# EAGLE design tk-retrofit (EAGLE 9.5.0)
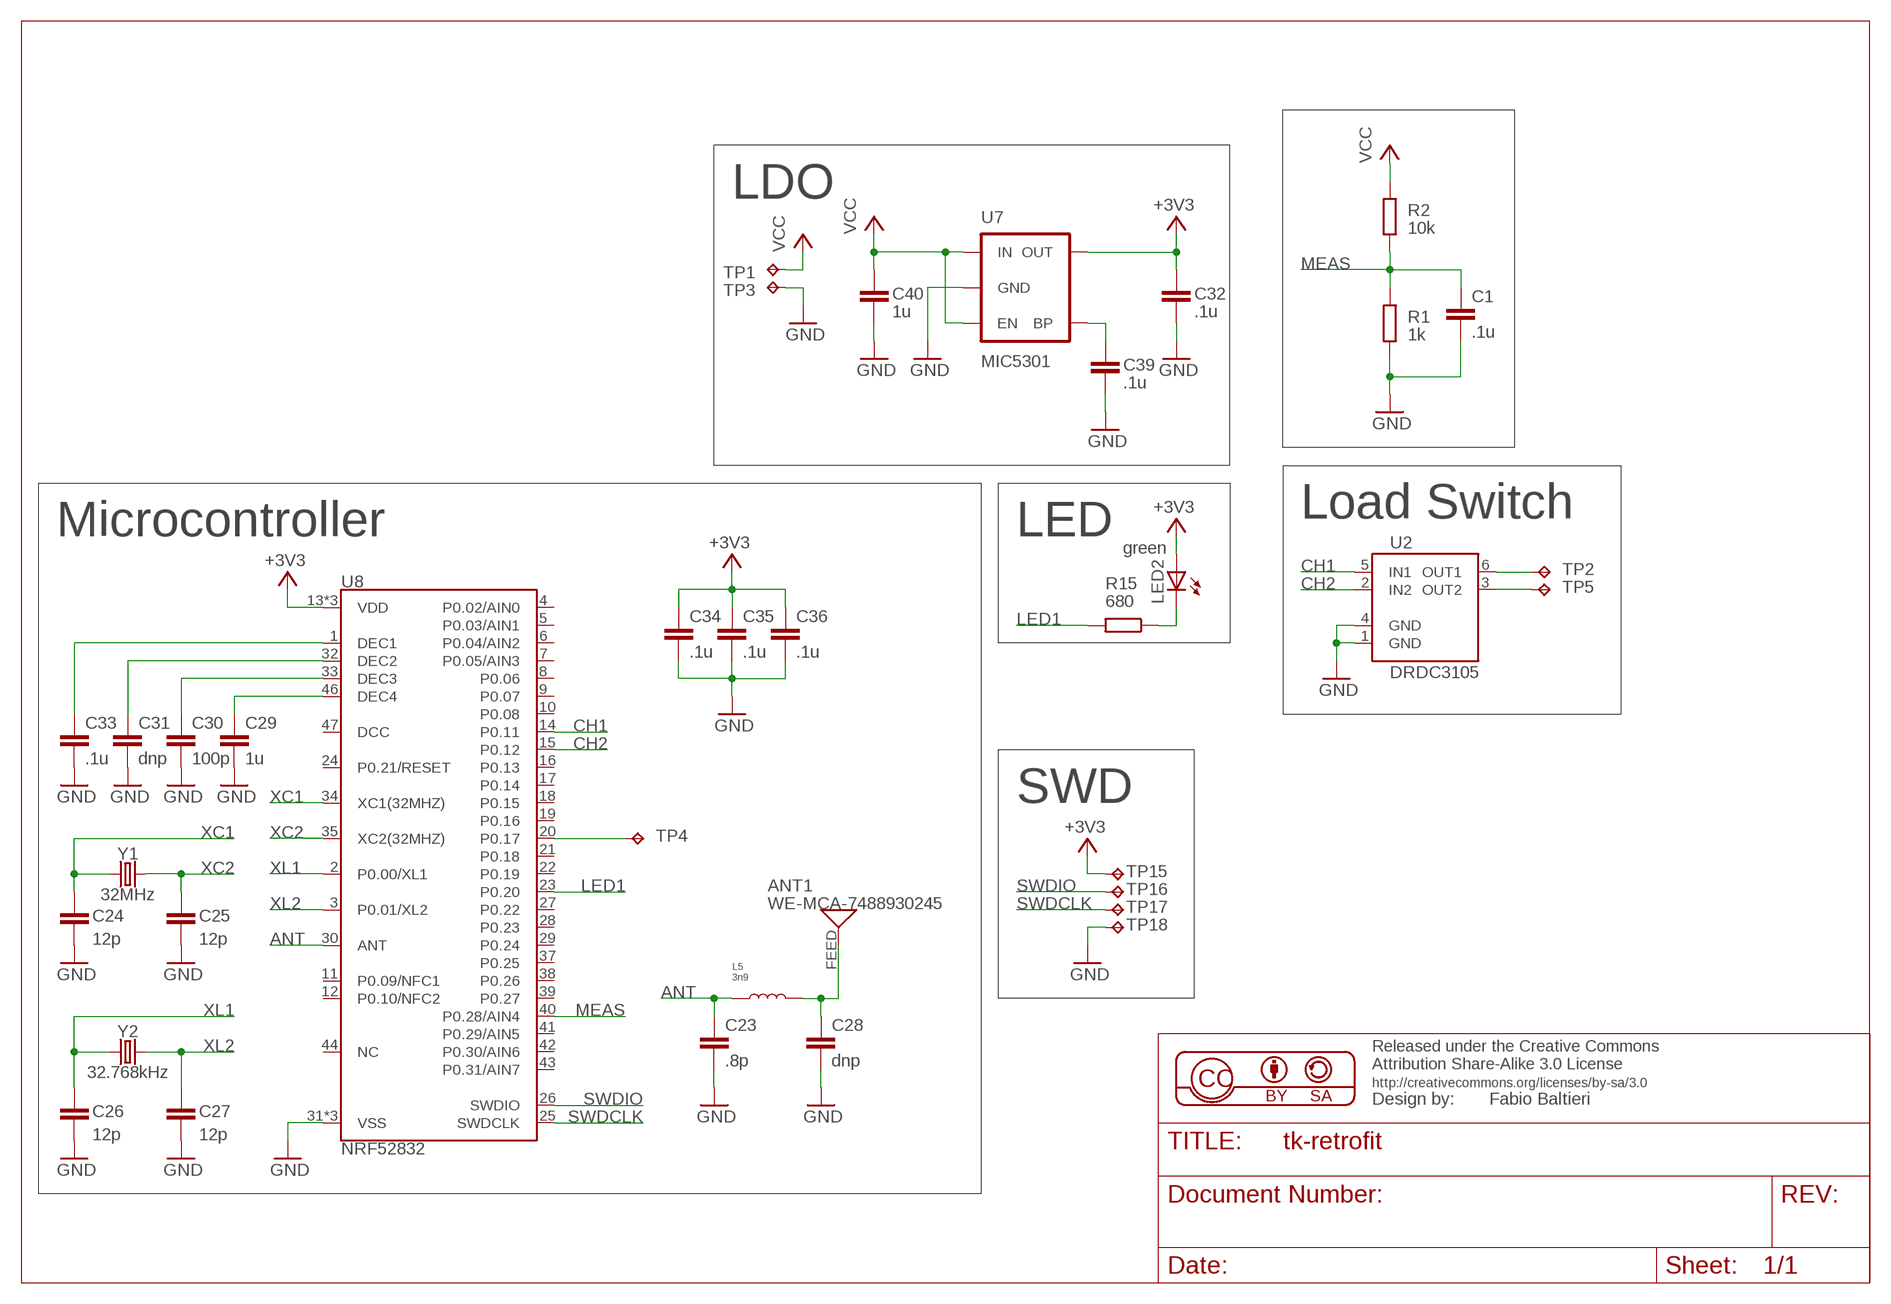
[diagram p0: schematic, sheet 1]

## Parts
ANT1  WE-MCA-7488930245  [WE-MCA]
C1  .1u  C0603  [0603]
C23  .8p  C0603  [0603]
C24  12p  C0603  [0603]
C25  12p  C0603  [0603]
C26  12p  C0603  [0603]
C27  12p  C0603  [0603]
C28  dnp  C0603  [0603]
C29  1u  C0603  [0603]
C30  100p  C0603  [0603]
C31  dnp  C0603  [0603]
C32  .1u  C0603  [0603]
C33  .1u  C0603  [0603]
C34  .1u  C0603  [0603]
C35  .1u  C0603  [0603]
C36  .1u  C0603  [0603]
C39  .1u  C0603  [0603]
C40  1u  C0603  [0603]
L5  3n9  INDUCTOR_0603  [L0603]
LED2  LEDSML0805  [SML0805]
R1  1k  R0603  [0603]
R2  10k  R0603  [0603]
R15  680  R0603  [0603]
TP1  TPTP12R  [TP12R]
TP2  TPTP12R  [TP12R]
TP3  TPTP12R  [TP12R]
TP4  TPTP12R  [TP12R]
TP5  TPTP12R  [TP12R]
TP15  TPTP12R  [TP12R]
TP16  TPTP12R  [TP12R]
TP17  TPTP12R  [TP12R]
TP18  TPTP12R  [TP12R]
U2  DRDC3105  [SOT23-6L]
U7  MIC5301  V_REG_LDOSMD  [SOT23-5]
U8  NRF52832  [QFN48-6X6MM]
Y1  32MHz  CRYSTALSMD-3.2X2.5  [CRYSTAL-SMD-3.2X2.5MM]
Y2  32.768kHz  CRYSTAL-32.768KHZSMD-3.2X1.5  [CRYSTAL-SMD-3.2X1.5MM]

## Nets
+3V3: C32.1 C34.1 C35.1 C36.1 LED2.A TP15.TP U7.5(OUT) U8.13(VDD) U8.36(VDD) U8.48(VDD)
ANT: C23.1 L5.P$1 U8.30(ANT)
CH1: U2.5(IN1) U8.14(P0.11)
CH2: U2.2(IN2) U8.15(P0.12)
GND: C1.2 C23.2 C24.2 C25.2 C26.2 C27.2 C28.2 C29.2 C30.2 C31.2 C32.2 C33.2 C34.2 C35.2 C36.2 C39.2 C40.2 R1.2 TP3.TP TP18.TP U2.1(GND) U2.4(GND) U7.2(GND) U8.31(VSS) U8.45(VSS) U8.EP(VSS)
LED1: R15.2 U8.23(P0.20)
MEAS: C1.1 R1.1 R2.2 U8.40(P0.28/AIN4)
N$1: TP2.TP U2.6(OUT1)
N$3: TP5.TP U2.3(OUT2)
N$11: TP4.TP U8.20(P0.17)
N$22: ANT1.FEED C28.1 L5.P$2
N$23: LED2.C R15.1
N$24: C29.1 U8.46(DEC4)
N$25: C30.1 U8.33(DEC3)
N$26: C31.1 U8.32(DEC2)
N$27: C33.1 U8.1(DEC1)
N$30: C39.1 U7.4(BP)
SWDCLK: TP17.TP U8.25(SWDCLK)
SWDIO: TP16.TP U8.26(SWDIO)
VCC: C40.1 R2.1 TP1.TP U7.1(IN) U7.3(EN)
XC1: C24.1 U8.34(XC1(32MHZ)) Y1.1
XC2: C25.1 U8.35(XC2(32MHZ)) Y1.3
XL1: C26.1 U8.2(P0.00/XL1) Y2.P$1
XL2: C27.1 U8.3(P0.01/XL2) Y2.P$2
Unconnected: U8.4(P0.02/AIN0) U8.5(P0.03/AIN1) U8.6(P0.04/AIN2) U8.7(P0.05/AIN3) U8.8(P0.06) U8.9(P0.07) U8.10(P0.08) U8.11(P0.09/NFC1) U8.12(P0.10/NFC2) U8.16(P0.13) U8.17(P0.14) U8.18(P0.15) U8.19(P0.16) U8.21(P0.18) U8.22(P0.19) U8.24(P0.21/RESET) U8.27(P0.22) U8.28(P0.23) U8.29(P0.24) U8.37(P0.25) U8.38(P0.26) U8.39(P0.27) U8.41(P0.29/AIN5) U8.42(P0.30/AIN6) U8.43(P0.31/AIN7) U8.44(NC) U8.47(DCC)

## Notes on the sheet
- LDO
- Load Switch
- Microcontroller | LED
- green
- SWD

## Library data of the parts
ANT1 = balto:WE-MCA: Wurth WE-MCA Multilayer Chip Antenna
C1 C23-C36 C39 C40 = balto:C: Capacitor
L5 = MF_Passives:INDUCTOR: Library: MF_Passives Description: Device for Inductors. Manufacture part number (MPN) can be added via Attributes. Check https://factory.macrofab.com/parts for the house parts list.; POPULATE: 1
LED2 = led:LED: LED OSRAM: - CHIPLED LG R971, LG N971, LY N971, LG Q971, LY Q971, LO R971, LY R971 LH N974, LH R974 LS Q976, LO Q976, LY Q976 LO Q996 - Hyper CHIPLED LW Q18S LB Q993, LB Q99A, LB R99A - SideLED LS A670, LO A670, LY A670, LG A670, LP A670 LB A673, LV A673, LT A673, LW A673 LH A674 LY A675 LS A676, LA A676, LO A676, LY A676, LW A676 LS A679, LY A679, LG A679 - Hyper Micro SIDELED® LS Y876, LA Y876, LO Y876, LY Y876 LT Y87S - SmartLED LW L88C, LW L88S LB L89C, LB L89S, LG L890 LS L89K, LO L89K, LY L89K LS L896, LA L896, LO L896, LY L896 - TOPLED LS T670, LO T670, LY T670, LG T670, LP T670 LSG T670, LSP T670, LSY T670, LOP T670, LYG T670 LG T671, LOG T671, LSG T671 LB T673, LV T673, LT T673, LW T673 LH T674 LS T676, LA T676, LO T676, LY T676, LB T676, LH T676, LSB T676, LW T676 LB T67C, LV T67C, LT T67C, LS T67K, LO T67K, LY T67K, LW E67C LS E67B, LA E67B, LO E67B, LY E67B, LB E67C, LV E67C, LT E67C LW T67C LS T679, LY T679, LG T679 LS T770, LO T770, LY T770, LG T770, LP T770 LB T773, LV T773, LT T773, LW T773 LH T774 LS E675, LA E675, LY E675, LS T675 LS T776, LA T776, LO T776, LY T776, LB T776 LHGB T686 LT T68C, LB T68C - Hyper Mini TOPLED® LB M676 - Mini TOPLED Santana® LG M470 LS M47K, LO M47K, LY M47K Source: http://www.osram.convergy.de LUXEON: - LUMILED® LXK2-PW12-R00, LXK2-PW12-S00, LXK2-PW14-U00, LXK2-PW14-V00 LXK2-PM12-R00, LXK2-PM12-S00, LXK2-PM14-U00 LXK2-PE12-Q00, LXK2-PE12-R00, LXK2-PE12-S00, LXK2-PE14-T00, LXK2-PE14-U00 LXK2-PB12-K00, LXK2-PB12-L00, LXK2-PB12-M00, LXK2-PB14-N00, LXK2-PB14-P00, LXK2-PB14-Q00 LXK2-PR12-L00, LXK2-PR12-M00, LXK2-PR14-Q00, LXK2-PR14-R00 LXK2-PD12-Q00, LXK2-PD12-R00, LXK2-PD12-S00 LXK2-PH12-R00, LXK2-PH12-S00 LXK2-PL12-P00, LXK2-PL12-Q00, LXK2-PL12-R00 Source: www.luxeon.com KINGBRIGHT: KA-3528ASYC Source: www.kingbright.com
R1 R2 R15 = balto:R: Resistor
TP1-TP5 TP15-TP18 = testpad:TP: Test pad
U2 = balto:DRDC3105: Integrated relay and inductive load driver https://www.mouser.ie/datasheet/2/115/DRDC3105-219294.pdf
U7 = SparkFun-PowerIC:V_REG_LDO: Voltage Regulator LDO Standard 150mA LDO voltage regulator in SOT-23 layout. Micrel part MIC5205. BP (by-pass) pin is used to lower output noise with 470pF cap.
U8 = SparkFun-RF:NRF52832: Nordic nRF52832 Bluetooth Smart/ANT/2.4GHz RF SoC The nRF52832 SoC is a powerful, highly flexible ultra-low power multiprotocol SoC ideally suited for Bluetooth® Smart ANT and 2.4GHz ultra low-power wireless applications. The nRF52832 SoC is built around a 32-bit ARM® Cortex™-M4F CPU with 512kB + 64kB RAM. The embedded 2.4GHz transceiver supports Bluetooth Smart, ANT and proprietary 2.4 GHz protocol stack. It is on air compatible with the nRF51 Series, nRF24L and nRF24AP Series products from Nordic Semiconductor. Datasheet <https://cdn.sparkfun.com/datasheets/Wireless/Bluetooth/nRF52832_PS_v1.0.pdf> SparkFun Products: SparkFun nRF52832 Breakout <https://www.sparkfun.com/products/13990>; PROD_ID: IC-13460
Y1 = SparkFun-Clocks:CRYSTAL: Crystals (Generic) These are passive quartz crystals, which can be used as a clock source for a microcontroller. Crystal's are two-terminal devices. They require external "load" capacitors to generate an oscillating signal.
Y2 = SparkFun-Clocks:CRYSTAL-32.768KHZ: 32.768kHz Crystal Frequency: 32.768kHz Frequency Stability: ±20ppm Load Capacitance: 12.5pF (PTH-2X6 & SMD-3.2X1.5), 6pF (SMD-2X6) SparkFun Products: SparkFun BigTime Watch Kit <https://www.sparkfun.com/products/11734> SparkFun nRF52832 Breakout <https://www.sparkfun.com/products/13990> SparkFun Real Time Clock Module <https://www.sparkfun.com/products/12708>; PROD_ID: XTAL-13062

## Board
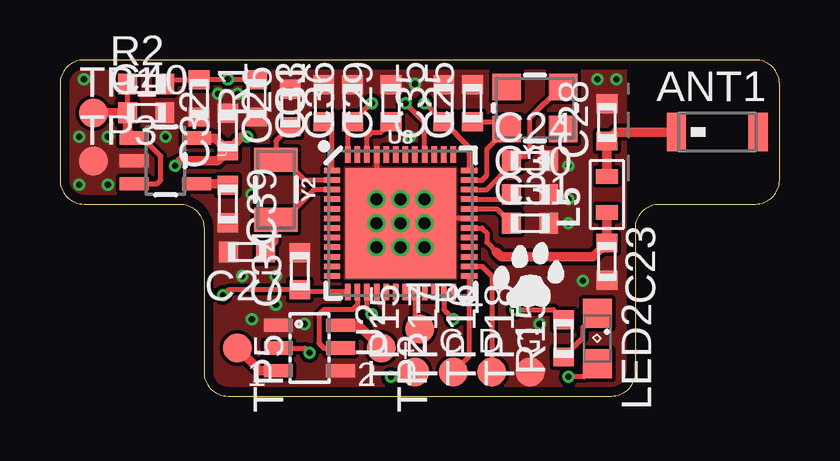
[diagram p1: board, top side]
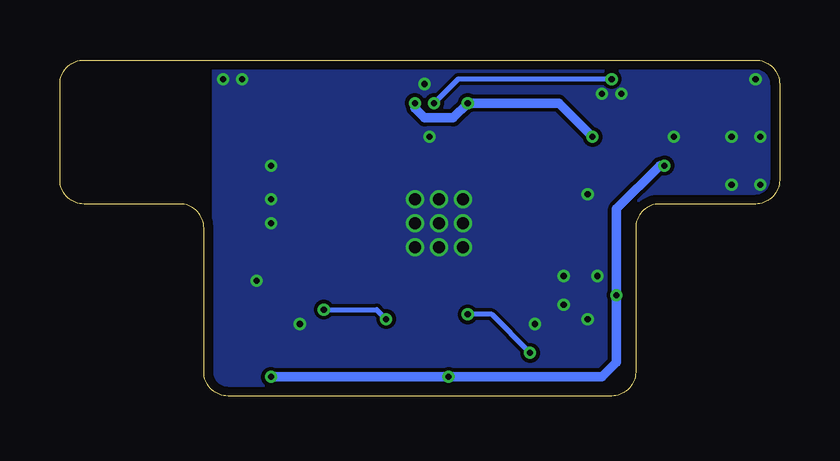
[diagram p2: board, bottom side, seen from below]

Size 30 x 14 mm. Coordinates in mm from the lower left corner, seen from the top.
Outline: 25,8 29,8 arc90 30,9 30,13 arc90 29,14 1,14 arc90 0,13 0,9 arc90 1,8 5,8 arc-90 6,7 6,1 arc90 7,0 23,0 arc90 24,1 24,7 arc-90 25,8
Copper layers (1*16): Top 0.035mm / dielectric 1.5mm / Bottom 0.035mm
Design rules "balto": minimum track width 6mil, minimum drill 10mil, track to track 6mil, track to pad 6mil, pad to pad 6mil, via to via 6mil, smd to smd 6mil, copper to edge 15mil, drill to drill 5mil, minimum pad ring 5mil, minimum via ring 5mil, stop-mask expansion 2mil, vias tented up to drill 20mil, thermal gap 8mil

### Footprints (pad centres in the part's own frame; a part is rotated, then mirrored left to right if it is on the bottom)
WE-MCA = smd 0.8 x 1.6: FEED -1.7,0; NC 1.7,0
0603 = smd 0.787 x 0.864: 1 -0.774,0; 2 0.774,0
L0603 = smd 0.6 x 0.9: P$1 -0.75,0; P$2 0.75,0
SML0805 = smd 1.2 x 1.2: A 1.05,0; C -1.05,0
TP12R = smd 1.2 x 1.2: TP 0,0
SOT23-6L = smd 0.55 x 1.2: 1 -0.95,-1.3; 2 0,-1.3; 3 0.95,-1.3; 4 0.95,1.3; 5 0,1.3; 6 -0.95,1.3
SOT23-5 = smd 0.55 x 1.2: 1 -0.95,-1.3; 2 0,-1.3; 3 0.95,-1.3; 4 0.95,1.3; 5 -0.95,1.3
QFN48-6X6MM = smd 0.68 x 0.23: 1 -2.86,2.2; 2 -2.86,1.8; 3 -2.86,1.4; 4 -2.86,1; 5 -2.86,0.6; 6 -2.86,0.2; 7 -2.86,-0.2; 8 -2.86,-0.6; 9 -2.86,-1; 10 -2.86,-1.4; 11 -2.86,-1.8; 12 -2.86,-2.2; 25 2.86,-2.2; 26 2.86,-1.8; 27 2.86,-1.4; 28 2.86,-1; 29 2.86,-0.6; 30 2.86,-0.2; 31 2.86,0.2; 32 2.86,0.6; 33 2.86,1; 34 2.86,1.4; 35 2.86,1.8; 36 2.86,2.2 | smd 0.23 x 0.68: 13 -2.2,-2.86; 14 -1.8,-2.86; 15 -1.4,-2.86; 16 -1,-2.86; 17 -0.6,-2.86; 18 -0.2,-2.86; 19 0.2,-2.86; 20 0.6,-2.86; 21 1,-2.86; 22 1.4,-2.86; 23 1.8,-2.86; 24 2.2,-2.86; 37 2.2,2.86; 38 1.8,2.86; 39 1.4,2.86; 40 1,2.86; 41 0.6,2.86; 42 0.2,2.86; 43 -0.2,2.86; 44 -0.6,2.86; 45 -1,2.86; 46 -1.4,2.86; 47 -1.8,2.86; 48 -2.2,2.86 | smd 4.6 x 4.6: EP 0,0
CRYSTAL-SMD-3.2X2.5MM = smd 1.2 x 1.1: 1 -1.175,-0.875; 2 1.175,-0.875; 3 1.175,0.875; 4 -1.175,0.875
CRYSTAL-SMD-3.2X1.5MM = smd 1 x 1.8: P$1 -1.25,0; P$2 1.25,0

### Placement (x,y rotation side)
ANT1  27.4,11 0 top
C1  8.2,12.4 270 top
C23  22.8,5.6 270 top
C24  19.6,9.8 0 top
C25  17.2,12.2 90 top
C26  9.6,12 90 top
C27  7.8,6 180 top
C28  22.8,11.4 90 top
C29  13.8,12.2 90 top
C30  19.6,8.4 0 top
C31  19.6,7.2 0 top
C32  7,11 90 top
C33  11,12.2 90 top
C34  10,5.2 90 top
C35  16,12.2 90 top
C36  12.2,12.2 90 top
C39  7,8 270 top
C40  3.6,11.8 0 top
L5  22.8,8.4 90 top
LED2  22.4,2.4 270 top
R1  5.8,12.4 270 top
R2  3.6,13 0 top
R15  21,2.4 90 top
TP1  1.4,11.8 0 top
TP2  13.4,2 270 top
TP3  1.4,9.8 0 top
TP4  15,2.8 0 top
TP5  7.4,2 270 top
TP15  14.8,1 90 top
TP16  18,1 90 top
TP17  16.4,1 90 top
TP18  19.6,1 90 top
U2  10.4,2 270 top
U7  4.4,9.8 270 top
U8  14.2,7.2 0 top
U$1  [CAT-L]  19.6,4.6 0 top
Y1  19.8,12 180 top
Y2  9,8.6 270 top

### Tracks (layer width: path | path; a pad name or v marks a point on that pad's centre or on a via)
+3V3  (via drill 0.25)
  Top 0.2: U8.36 17.06,10.37 C35.1 15.23,12.2 v15.2,12.2 | U8.48 12,11.23 C36.1 12.97,12.2 v13,12.2 | LED2.A 21.85,0.8 v21.2,0.8 | U8.13 10.09,4.34 C34.1 7.03,4.43 v6.8,4.2
  Top 0.4: U7.5 6.48,10.75 C32.1 | C32.1 6.57,9.8 5,9.8 v4.8,9.6 | C32.1 7.57,10.8 v7.8,10.8 | TP15.TP 14.6,0.8 v13.8,0.8
  Bottom 0.4: v21.2,0.8 v13.8,0.8 7.4,0.8 6.8,1.4 v6.8,4.2 6.8,7.8 5,9.6 v4.8,9.6 | v7.8,10.8 9.2,12.2 v13,12.2 13.61,11.59 14.79,11.59 15.2,12 v15.2,12.2
ANT
  Top 0.2: U8.30 17.6,7 17.8,6.8 17.8,6.4 18.2,6
  Top 0.4: 18.2,6 18.4,5.8 22.23,5.8 C23.1 L5.P$1
CH1
  Top 0.2: U8.14 12.4,3.8 12.2,3.6 11,3.6 10.8,3.4 10.8,2.2 11,2 U2.5
CH2  (via drill 0.25)
  Top 0.2: U2.2 10.2,2 v10.4,1.8 | v13,3.4 12.8,3.6 U8.15
  Bottom 0.2: v10.4,1.8 12,3.4 v13,3.4
GND  (via drill 0.25, 0.51)
  Top 0.2: U8.31 14.4,7.4 U8.EP v13.2,8.2 U8.45
  other vias: 1,13.2 14.2,7.2 4.4,10.8 7.4,12.6 6.6,12.6 0.8,10.8 2,10.8 2,8.8 0.8,8.8 14.6,10.8 8,8.4 9,3.8 8,3.2 10.2,3 15.2,8.2 14.2,8.2 13.2,7.2 13.2,6.2 14.2,6.2 15.2,6.2 15.2,7.2 21.2,7.2 21.2,8.2 21.2,9.6 20,3 7.6,5 9,5 21.8,4.8 23.2,13.2 22.4,13.2 14.8,13
  pour Top (no thermals): -1,-1 23.6,-1 23.6,15 -1,15
  pour Bottom (no thermals): -2,-2 23.6,-2 23.6,16 -2,16
LED1  (via drill 0.25)
  Top 0.2: U8.23 16,3.6 v16.4,3.2 | v19,3.6 20.57,3.6 R15.2
  Bottom 0.2: v16.4,3.2 16.8,3.6 v19,3.6
MEAS  (via drill 0.25)
  Top 0.2: R2.2 4.55,13.18 R1.1 5.83,13.2 v7,13.2 8.18,13.2 C1.1 | U8.40 15.2,11.4 v14.4,12.2
  Bottom 0.2: v14.4,12.2 13.4,13.2 v7,13.2
N$1
  Top 0.4: U2.6 12.45,2.95 TP2.TP
N$3
  Top 0.4: U2.3 8.35,1.05 TP5.TP
N$11
  Top 0.2: U8.20 14.8,3 TP4.TP
N$22
  Top 0.4: L5.P$2 C28.1 23.17,11 ANT1.FEED
N$23
  Top 0.2: R15.1 21.8,2.42 21.8,2.85 LED2.C
N$24
  Top 0.2: C29.1 13.8,11.4 13.4,11 13,11 12.8,10.8 U8.46
N$25
  Top 0.2: U8.33 18.62,8.2 C30.1
N$26
  Top 0.2: U8.32 18.23,7.8 C31.1
N$27
  Top 0.2: U8.1 11.34,11.09 C33.1
N$30
  Top 0.4: U7.4 6.92,8.85 C39.1
SWDCLK
  Top 0.2: U8.25 17.06,1.66 TP17.TP
SWDIO
  Top 0.2: U8.26 17.6,5.4 18,5 TP16.TP
VCC
  Top 0.2: 3.03,10.82 U7.1 3.45,10.75 4.2,10 4.2,9 4.05,8.85 U7.3 | C40.1 R2.1
  Top 0.4: TP1.TP C40.1 2.83,11.02 3.03,10.82
XC1
  Top 0.2: U8.34 17.8,8.6 18.83,9.63 C24.1 19.03,10 19.4,10 19.6,10.2 19.6,11.6 20.88,12.88 Y1.1
XC2
  Top 0.2: U8.35 17.6,9 17.8,9.2 17.8,10.3 Y1.3 18.32,11.43 C25.1
XL1
  Top 0.2: U8.2 10.2,9 9.35,9.85 Y2.P$1 9,10.63 C26.1
XL2
  Top 0.2: U8.3 10.6,8.6 9.35,7.35 Y2.P$2 9,6.43 C27.1

### Text on the board
_tsilk: C | D | G | + | 1 | 2